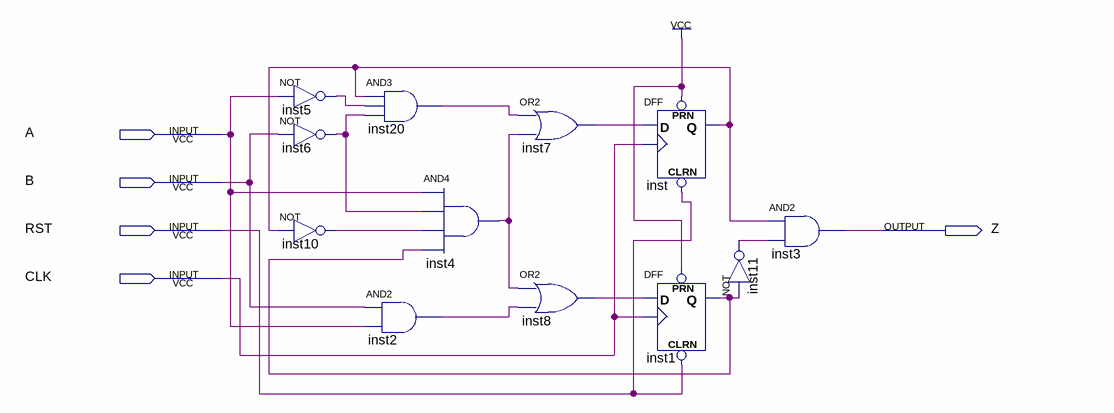
[diagram p0: schematic sheet]
// Quartus schematic Ex9.bdf as structural Verilog: 12 symbols, 5 pins
module Ex9 (
  input  A,
  input  B,
  input  RST,
  input  CLK,
  output Z
);

  wire inst1_q, inst2_out, inst4_out, inst5_out, inst6_out, inst7_out, inst8_out, inst10_out, inst11_out,
       inst20_out, inst_q;

  not inst5 (inst5_out, A);
  not inst6 (inst6_out, B);
  not inst10 (inst10_out, inst_q);
  and inst20 (inst20_out, inst_q, inst5_out, inst6_out);
  and inst2 (inst2_out, B, A);
  and inst4 (inst4_out, A, inst6_out, inst10_out, inst1_q);
  or inst7 (inst7_out, inst20_out, inst4_out);
  or inst8 (inst8_out, inst4_out, inst2_out);
  DFF inst (.CLRN(RST), .CLK(CLK), .D(inst7_out), .PRN(1'b1), .Q(inst_q));
  DFF inst1 (.CLRN(RST), .CLK(CLK), .D(inst8_out), .PRN(1'b1), .Q(inst1_q));
  and inst3 (Z, inst_q, inst11_out);
  not inst11 (inst11_out, inst1_q);
endmodule
